# EasyEDA schematic i-ching_2020-06-26_04-06-56.json

## Sheets
1 I-Ching device overview: TITLE: I-Ching device overview; REV: 1.0; Date: 2020-06-26; Sheet: 1/1; Drawn By: ferrie.bank; Company: Oude Snepelaar
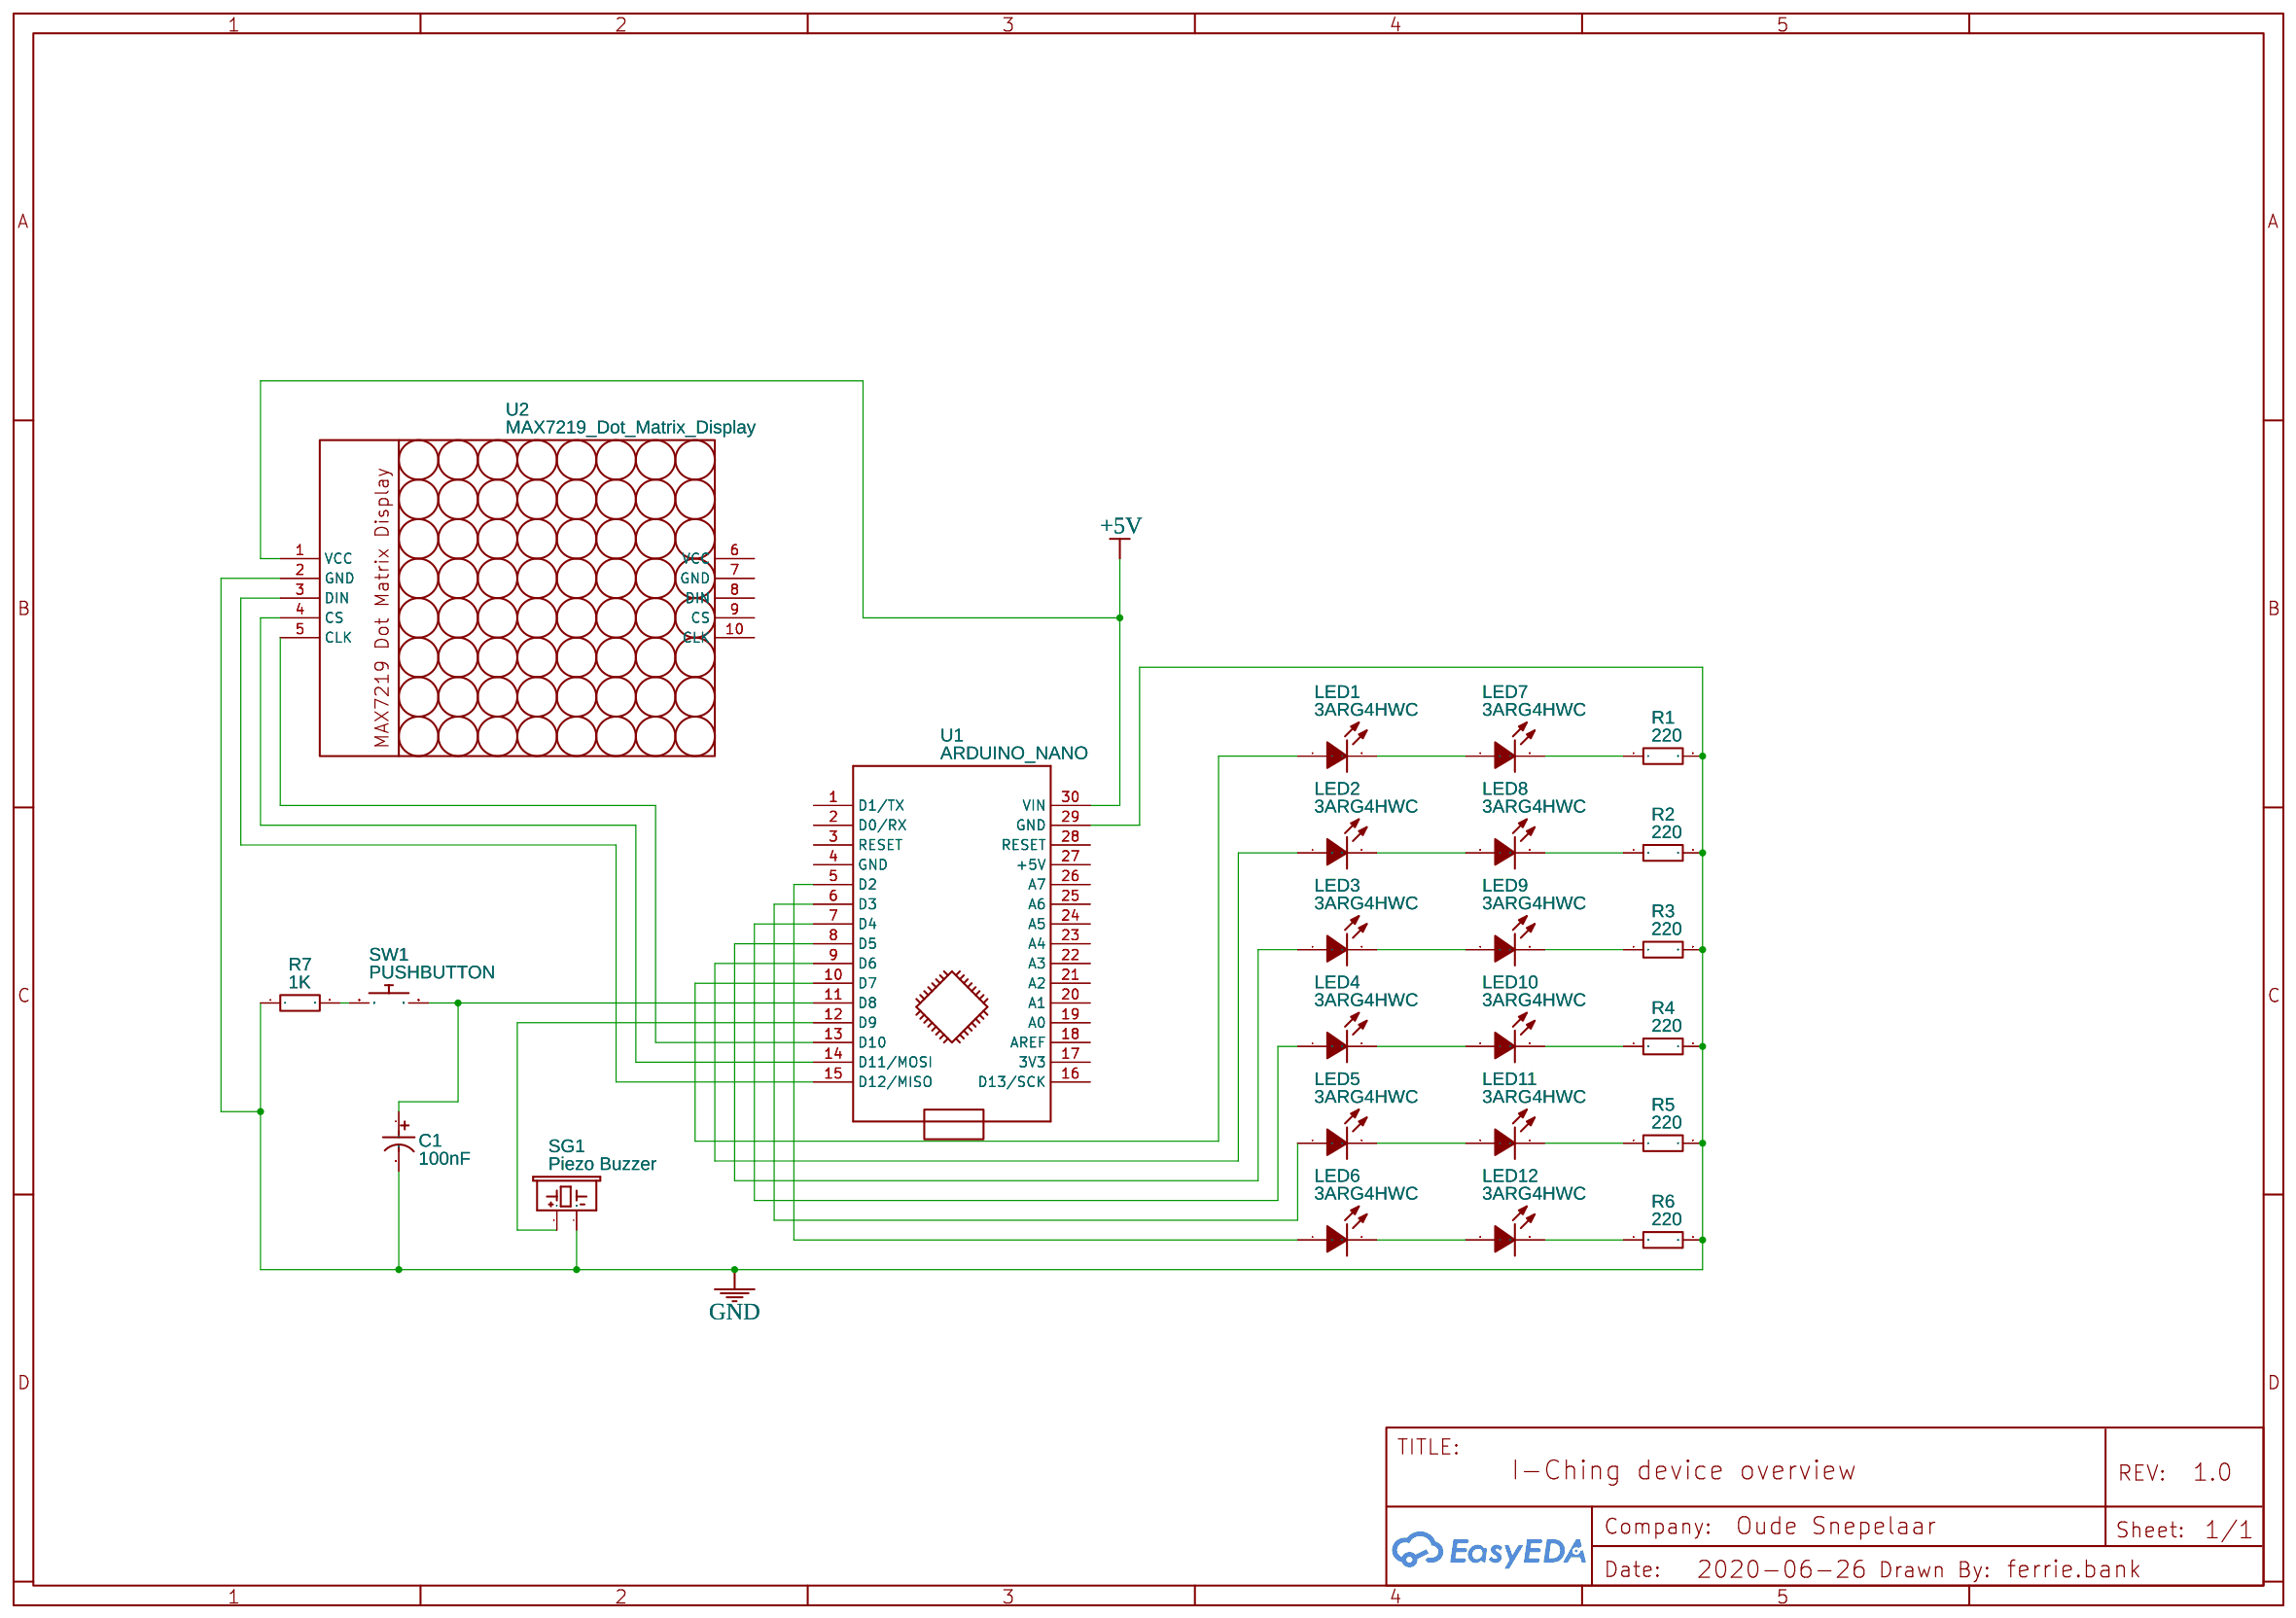
[diagram p0: I-Ching device overview]
2 I-Ching connection board: TITLE: I-Ching connection board
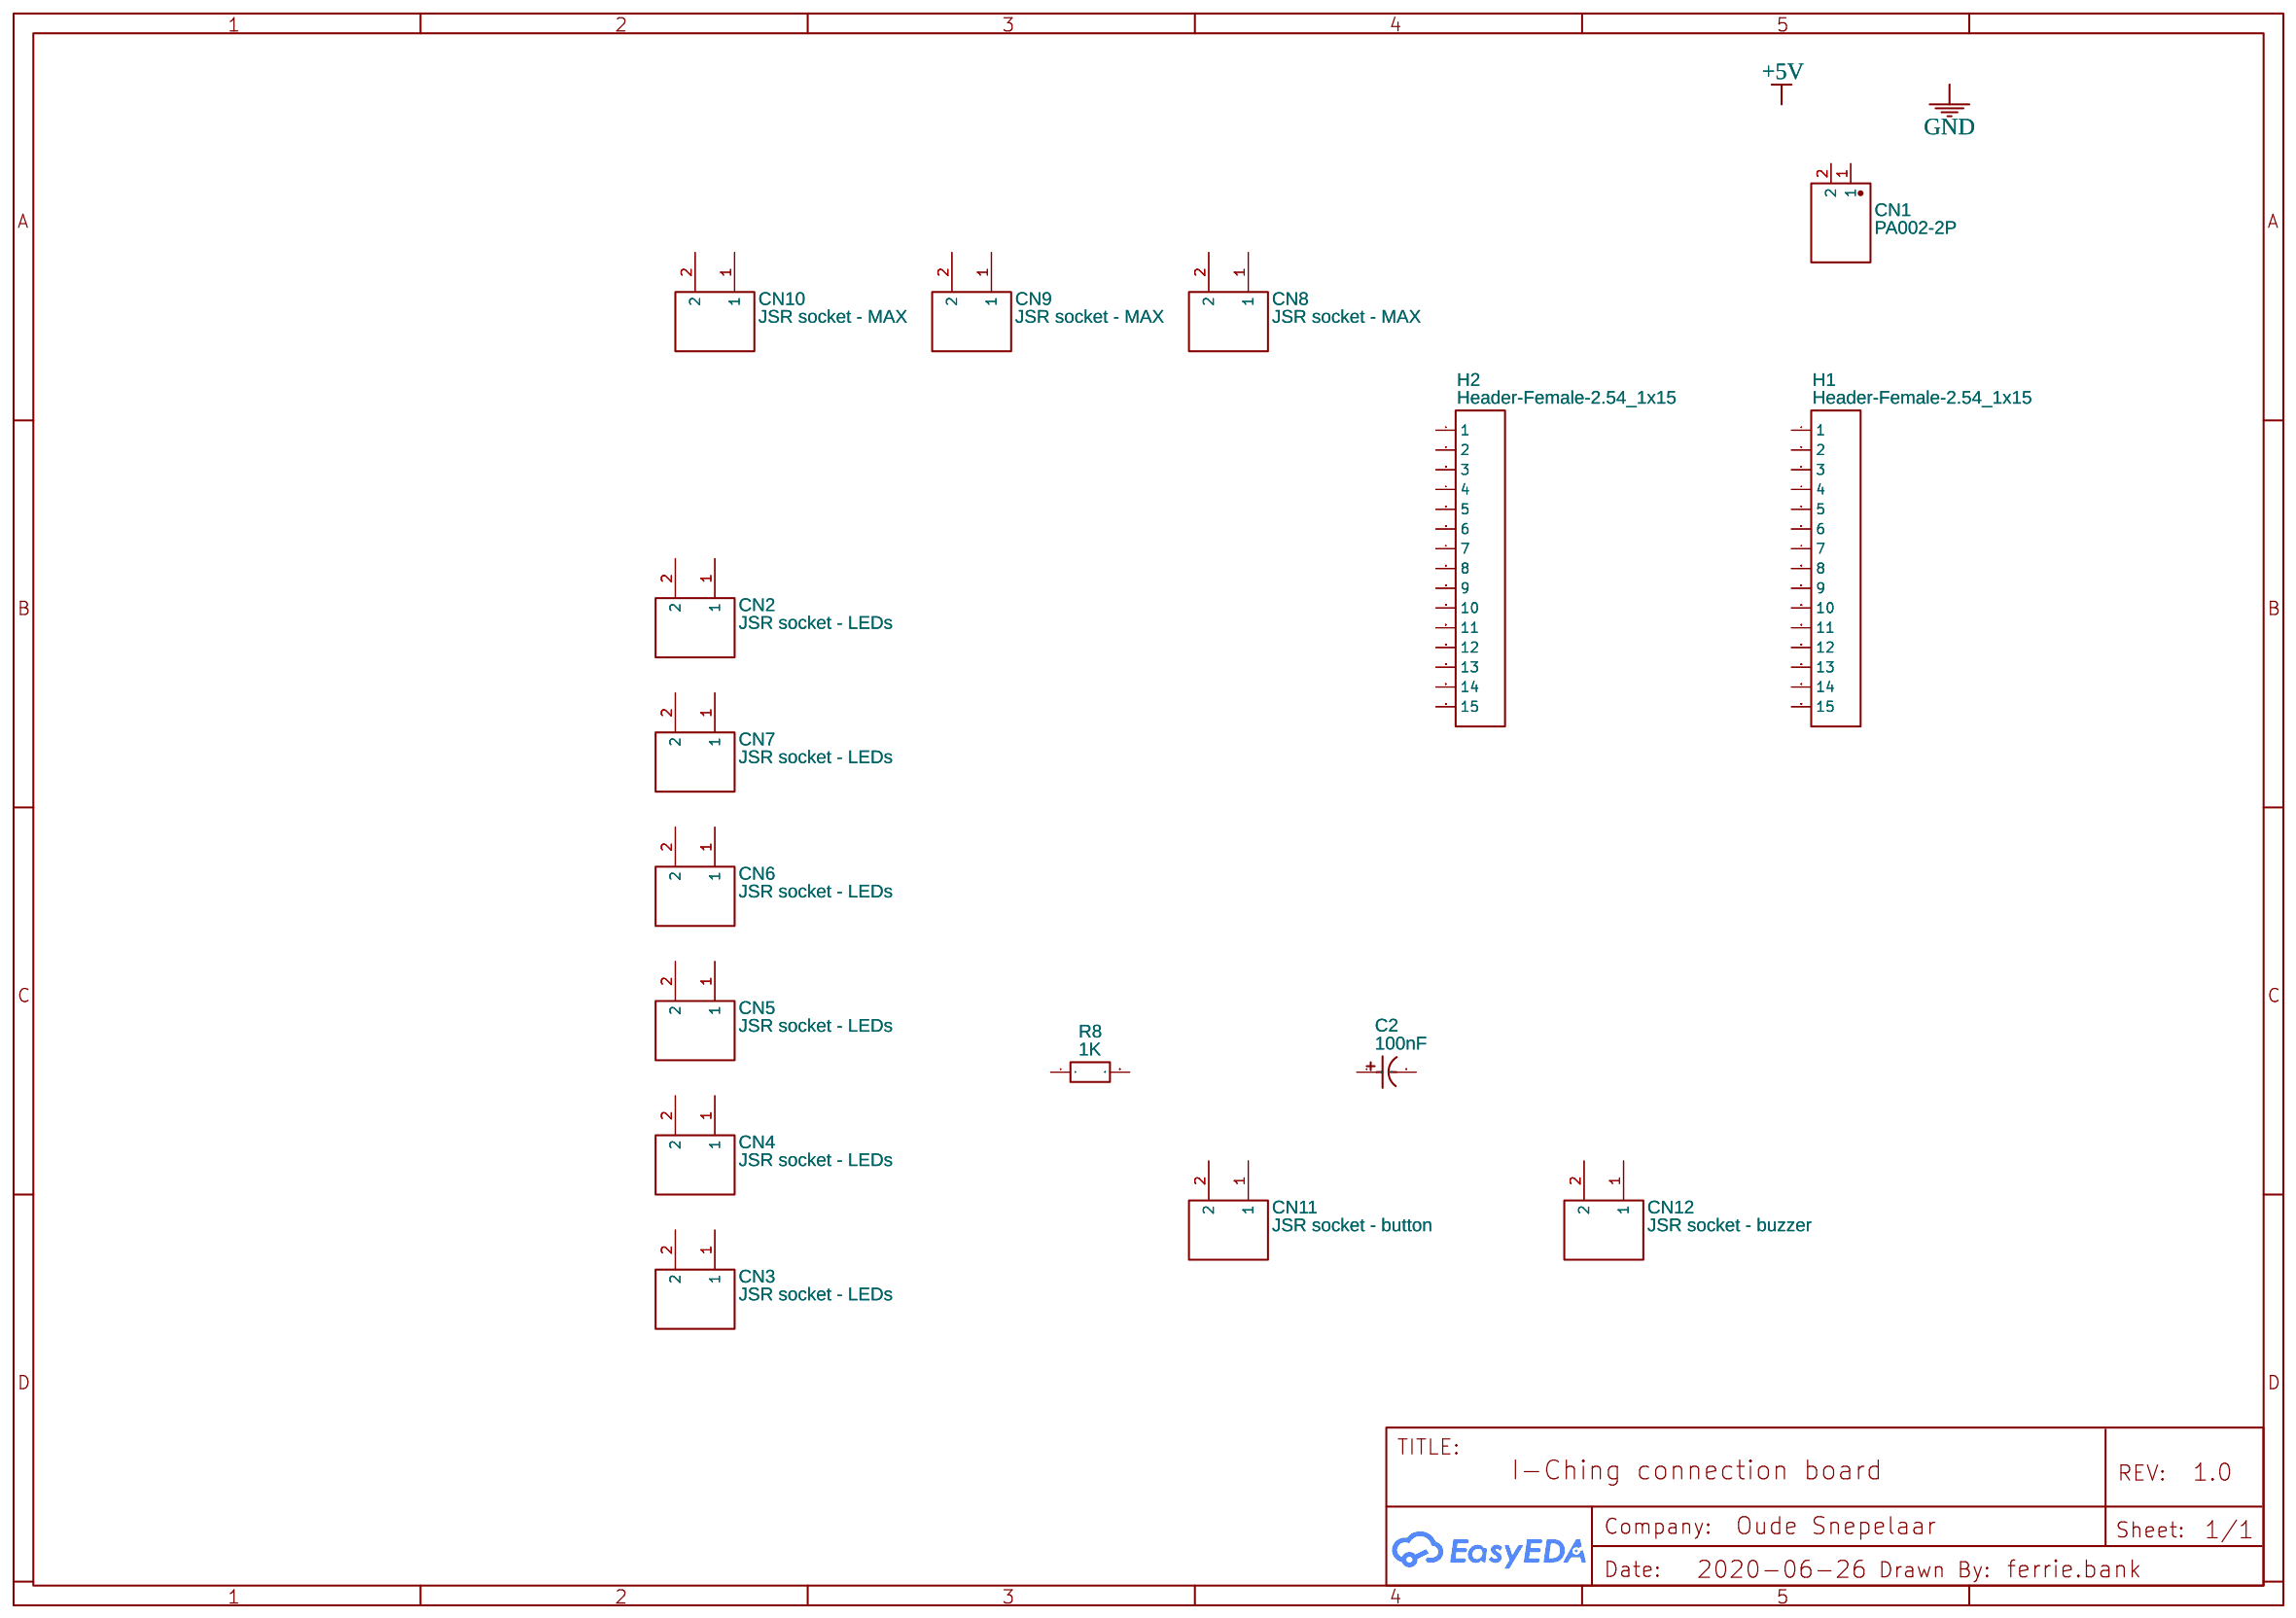
[diagram p1: I-Ching connection board]

## Parts
sheet I-Ching connection board
C2  100nF  [CAP-TH_BD5.0-P2.00-D0.8-FD]
CN1  PA002-2P  [CONN-TH_2P-P5.08_PA002-2P]
CN2  JSR socket - LEDs  [CONN-TH_SOCKET.BLUE5566-2ANEEDLE]
CN3  JSR socket - LEDs  [CONN-TH_SOCKET.BLUE5566-2ANEEDLE]
CN4  JSR socket - LEDs  [CONN-TH_SOCKET.BLUE5566-2ANEEDLE]
CN5  JSR socket - LEDs  [CONN-TH_SOCKET.BLUE5566-2ANEEDLE]
CN6  JSR socket - LEDs  [CONN-TH_SOCKET.BLUE5566-2ANEEDLE]
CN7  JSR socket - LEDs  [CONN-TH_SOCKET.BLUE5566-2ANEEDLE]
CN8  JSR socket - MAX  [CONN-TH_SOCKET.BLUE5566-2ANEEDLE]
CN9  JSR socket - MAX  [CONN-TH_SOCKET.BLUE5566-2ANEEDLE]
CN10  JSR socket - MAX  [CONN-TH_SOCKET.BLUE5566-2ANEEDLE]
CN11  JSR socket - button  [CONN-TH_SOCKET.BLUE5566-2ANEEDLE]
CN12  JSR socket - buzzer  [CONN-TH_SOCKET.BLUE5566-2ANEEDLE]
H1  Header-Female-2.54_1x15  [HDR-TH_15P-P2.54-V]
H2  Header-Female-2.54_1x15  [HDR-TH_15P-P2.54-V]
R8  1K  [RES-TH_BD4.5-L11.0-P15.00-D0.8]
sheet I-Ching device overview
C1  100nF  [CAP-TH_BD5.0-P2.00-D0.8-FD]
LED1  3ARG4HWC  [LED-TH_BD3.8-P2.54-FD]
LED2  3ARG4HWC  [LED-TH_BD3.8-P2.54-FD]
LED3  3ARG4HWC  [LED-TH_BD3.8-P2.54-FD]
LED4  3ARG4HWC  [LED-TH_BD3.8-P2.54-FD]
LED5  3ARG4HWC  [LED-TH_BD3.8-P2.54-FD]
LED6  3ARG4HWC  [LED-TH_BD3.8-P2.54-FD]
LED7  3ARG4HWC  [LED-TH_BD3.8-P2.54-FD]
LED8  3ARG4HWC  [LED-TH_BD3.8-P2.54-FD]
LED9  3ARG4HWC  [LED-TH_BD3.8-P2.54-FD]
LED10  3ARG4HWC  [LED-TH_BD3.8-P2.54-FD]
LED11  3ARG4HWC  [LED-TH_BD3.8-P2.54-FD]
LED12  3ARG4HWC  [LED-TH_BD3.8-P2.54-FD]
R1  220  [RES-TH_BD4.0-L11.5-P15.50-D0.7]
R2  220  [RES-TH_BD4.0-L11.5-P15.50-D0.7]
R3  220  [RES-TH_BD4.0-L11.5-P15.50-D0.7]
R4  220  [RES-TH_BD4.0-L11.5-P15.50-D0.7]
R5  220  [RES-TH_BD4.0-L11.5-P15.50-D0.7]
R6  220  [RES-TH_BD4.0-L11.5-P15.50-D0.7]
R7  1K  [RES-TH_BD5.0-L15.5-P19.50-D0.7]
SG1  Piezo Buzzer  [BUZZER-12MM]
SW1  PUSHBUTTON  [BTN_CK_KSS]
U1  ARDUINO_NANO  [ARDUINO_NANO]
U2  MAX7219_Dot_Matrix_Display  [MAX7219_LED_MATRIX]

## Library data of the parts
C1 C2 = 0.1UF 50V: Supplier: LCSC; Manufacturer: ValuePro; Supplier Part: C28061
CN1 = PA002-2P: Supplier: LCSC; Supplier Part: C163148; Manufacturer: HIWA; Contributor: LCSC
CN2-CN12 = socket.blue5566-2Aneedle: Supplier: LCSC; Manufacturer: BOOMELE; image: //image.lceda.cn/szlcsc/C62133.jpg; Supplier Part: C62133
H1 H2 = Header-Female-2.54_1x15: Supplier: LCSC; Manufacturer: Ckmtw; Manufacturer Part: 220S-1*15P H=8.5MM Ytype Gold-plated; Supplier Part: C124408
R8 = RN 2WS 1K F T/B A1_C433624: Supplier: LCSC; Supplier Part: C433624; Manufacturer: TyoHM; Manufacturer Part: RN 2WS 1K F T/B A1; Contributor: LCSC
LED1-LED12 = 3ARG4HWC: Supplier: LCSC; Manufacturer: KENTO; image: //image.lceda.cn/szlcsc/C55640.jpg; Supplier Part: C55640
R1-R6 = MFR2WSJT-73-220R: Supplier: LCSC; Supplier Part: C176568; Manufacturer: YAGEO; Contributor: LCSC
R7 = MFR02SF1001A10: Supplier: LCSC; Manufacturer: UniOhm; Supplier Part: C58742
SG1 = Piezo Buzzer: Contributor: SparkFun; sourceId: 0s1nhpZJj
SW1 = SWITCH_PUSHBUTTONCK_KSS: Buttons
U1 = ARDUINO_NANO: sourceId: KGSeAWhDB
U2 = MAX7219_Dot_Matrix_Display: Contributor: O. Bender

## Nets
+5V: U1.30(VIN) U2.1(VCC)
GND: C1.2 R1.2 R2.2 R3.2 R4.2 R5.2 R6.2 R7.1 SG1.-(2) U1.29(GND) U2.2(GND)
Net-(C1-1): C1.1 SW1.P$2 U1.11(D8)
Net-(LED1-1): LED1.1(A) U1.10(D7)
Net-(LED1-2): LED1.2(K) LED7.1(A)
Net-(LED2-1): LED2.1(A) U1.9(D6)
Net-(LED2-2): LED2.2(K) LED8.1(A)
Net-(LED3-1): LED3.1(A) U1.8(D5)
Net-(LED3-2): LED3.2(K) LED9.1(A)
Net-(LED4-1): LED4.1(A) U1.7(D4)
Net-(LED4-2): LED4.2(K) LED10.1(A)
Net-(LED5-1): LED5.1(A) U1.6(D3)
Net-(LED5-2): LED5.2(K) LED11.1(A)
Net-(LED6-1): LED6.1(A) U1.5(D2)
Net-(LED6-2): LED6.2(K) LED12.1(A)
Net-(LED7-2): LED7.2(K) R1.1
Net-(LED8-2): LED8.2(K) R2.1
Net-(LED9-2): LED9.2(K) R3.1
Net-(LED10-2): LED10.2(K) R4.1
Net-(LED11-2): LED11.2(K) R5.1
Net-(LED12-2): LED12.2(K) R6.1
Net-(R7-2): R7.2 SW1.P$1
Net-(SG1-+): SG1.+(1) U1.12(D9)
Net-(U1-13): U1.13(D10) U2.5(CLK)
Net-(U1-14): U1.14(D11/MOSI) U2.4(CS)
Net-(U1-15): U1.15(D12/MISO) U2.3(DIN)

Not connected (* = marked no-connect by the designer): C2 1 2; CN1 1 2; CN2 1 2; CN3 1 2; CN4 1 2; CN5 1 2; CN6 1 2; CN7 1 2; CN8 1 2; CN9 1 2; CN10 1 2; CN11 1 2; CN12 1 2; H1 1 2 3 4 5 6 7 8 9 10 11 12 13 14 15; H2 1 2 3 4 5 6 7 8 9 10 11 12 13 14 15; R8 1 2; U1 1(D1/TX) 2(D0/RX) 3(RESET) 4(GND) 16(D13/SCK) 17(3V3) 18(AREF) 19(A0) 20(A1) 21(A2) 22(A3) 23(A4) 24(A5) 25(A6) 26(A7) 27(+5V) 28(RESET); U2 6(VCC) 7(GND) 8(DIN) 9(CS) 10(CLK)
